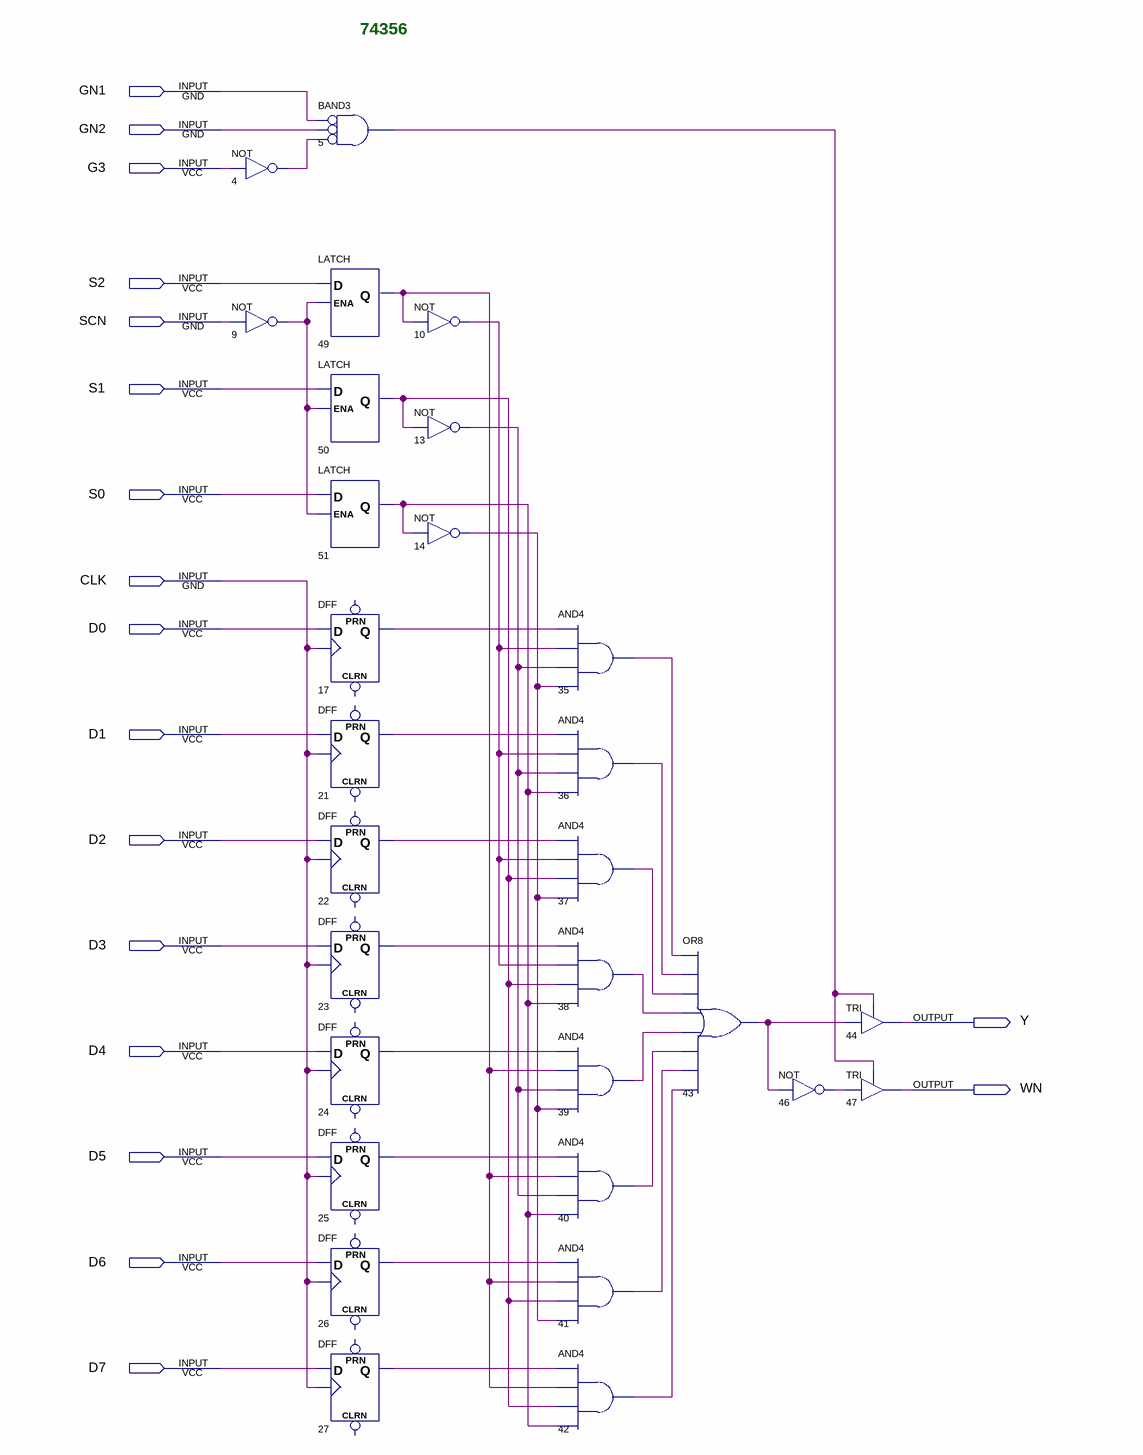
[diagram p0: schematic sheet]
// Quartus schematic 74356.bdf as structural Verilog: 29 symbols, 18 pins
module \74356  (
  input  GN1,
  input  GN2,
  input  G3,
  input  S2,
  input  SCN,
  input  S1,
  input  S0,
  input  CLK,
  input  D0,
  input  D1,
  input  D2,
  input  D3,
  input  D4,
  input  D5,
  input  D6,
  input  D7,
  output Y,
  output WN
);

  wire n4_out, n5_out, n9_out, n10_out, n13_out, n14_out, n17_q, n21_q, n22_q, n23_q, n24_q, n25_q, n26_q,
       n27_q, n35_out, n36_out, n37_out, n38_out, n39_out, n40_out, n41_out, n42_out, n43_out, n46_out,
       n49_q, n50_q, n51_q;

  not u_4 (n4_out, G3);
  not u_9 (n9_out, SCN);
  and u_5 (n5_out, ~GN1, ~GN2, ~n4_out);  // BAND3
  LATCH u_49 (.D(S2), .ENA(n9_out), .Q(n49_q));
  LATCH u_50 (.D(S1), .ENA(n9_out), .Q(n50_q));
  LATCH u_51 (.D(S0), .ENA(n9_out), .Q(n51_q));
  DFF u_17 (.CLK(CLK), .D(D0), .Q(n17_q));  // open: CLRN, PRN
  DFF u_21 (.CLK(CLK), .D(D1), .Q(n21_q));  // open: CLRN, PRN
  DFF u_22 (.CLK(CLK), .D(D2), .Q(n22_q));  // open: CLRN, PRN
  DFF u_23 (.CLK(CLK), .D(D3), .Q(n23_q));  // open: CLRN, PRN
  DFF u_24 (.CLK(CLK), .D(D4), .Q(n24_q));  // open: CLRN, PRN
  DFF u_25 (.CLK(CLK), .D(D5), .Q(n25_q));  // open: CLRN, PRN
  DFF u_26 (.CLK(CLK), .D(D6), .Q(n26_q));  // open: CLRN, PRN
  DFF u_27 (.CLK(CLK), .D(D7), .Q(n27_q));  // open: CLRN, PRN
  not u_10 (n10_out, n49_q);
  not u_13 (n13_out, n50_q);
  not u_14 (n14_out, n51_q);
  and u_35 (n35_out, n17_q, n10_out, n13_out, n14_out);
  and u_36 (n36_out, n21_q, n10_out, n13_out, n51_q);
  and u_37 (n37_out, n22_q, n10_out, n50_q, n14_out);
  and u_38 (n38_out, n23_q, n10_out, n50_q, n51_q);
  and u_39 (n39_out, n24_q, n49_q, n13_out, n14_out);
  and u_40 (n40_out, n25_q, n49_q, n13_out, n51_q);
  and u_41 (n41_out, n26_q, n49_q, n50_q, n14_out);
  and u_42 (n42_out, n27_q, n49_q, n50_q, n51_q);
  or u_43 (n43_out, n35_out, n36_out, n37_out, n38_out, n39_out, n40_out, n41_out, n42_out);
  not u_46 (n46_out, n43_out);
  TRI u_44 (.IN(n43_out), .OE(n5_out), .OUT(Y));
  TRI u_47 (.IN(n46_out), .OE(n5_out), .OUT(WN));

  // Notes on the sheet:
  //   74356
endmodule
